# EAGLE schematic RastoMower_bckp220817 (EAGLE 9.6.2)

## Sheet 1 of 2: Input
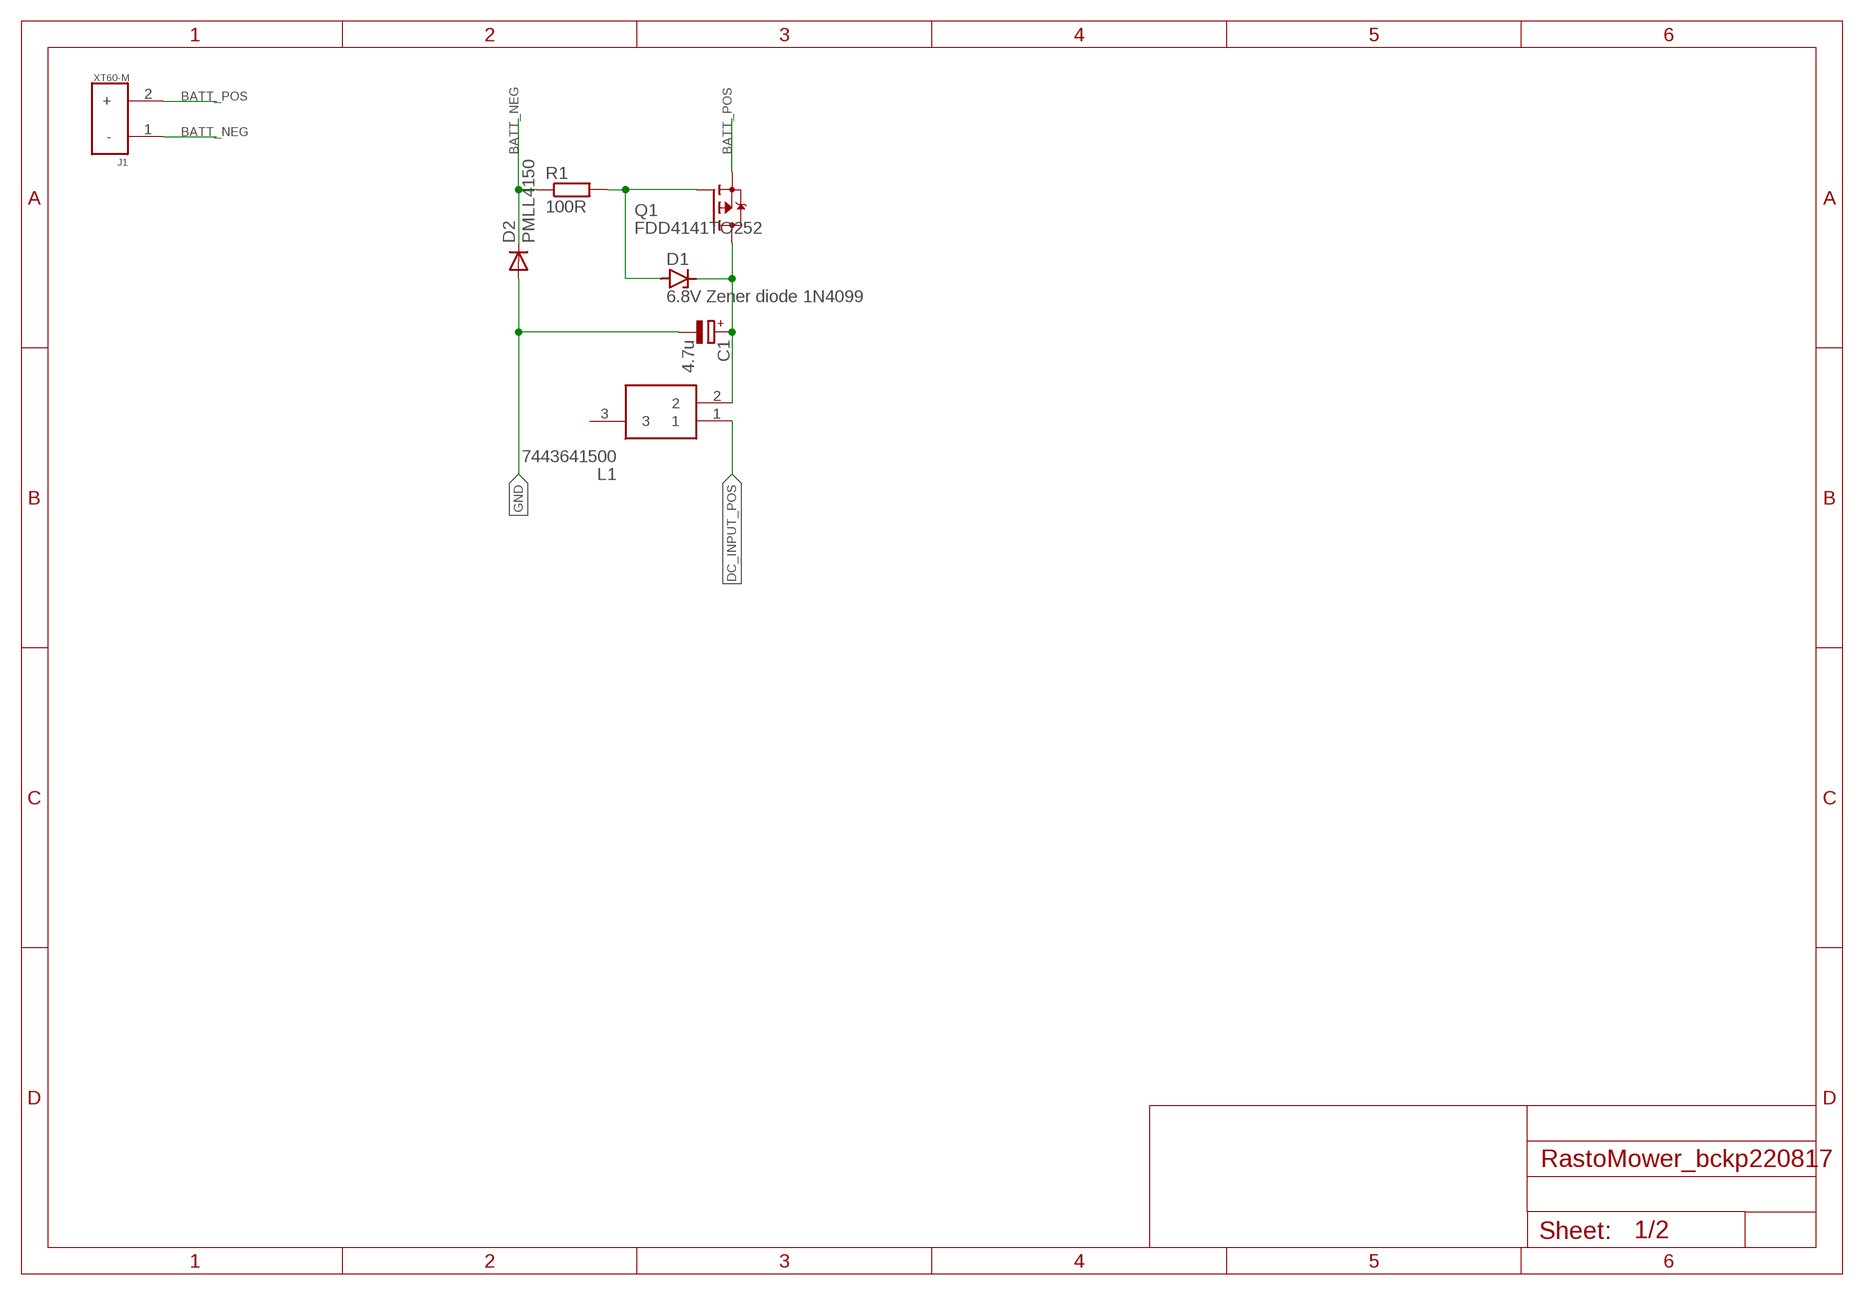
[diagram p0: schematic, sheet 1]

### Parts
C1  4.7u  CPOL-EUE2.5-5  [E2,5-5]
D1  6.8V Zener diode 1N4099  ZENER-DIODEP1-Z12  [P1Z12]
D2  PMLL4150  [SOD80C]
J1  XT60-M  [AMASS_XT60-M]
L1  7443641500  [74436413300]
Q1  FDD4141TO252  [TO252]
R1  100R  R-EU_R0805  [R0805]

### Nets
BATT_NEG: D2.C J1.1(-) R1.1
BATT_POS: J1.2(+) Q1.2(S)
DC_INPUT_POS: L1.1
GND: C1.- D2.A
N$1: D1.A Q1.1(G) R1.2
N$2: C1.+ D1.C L1.2 Q1.3(D)
Unconnected: L1.3

## Sheet 2 of 2
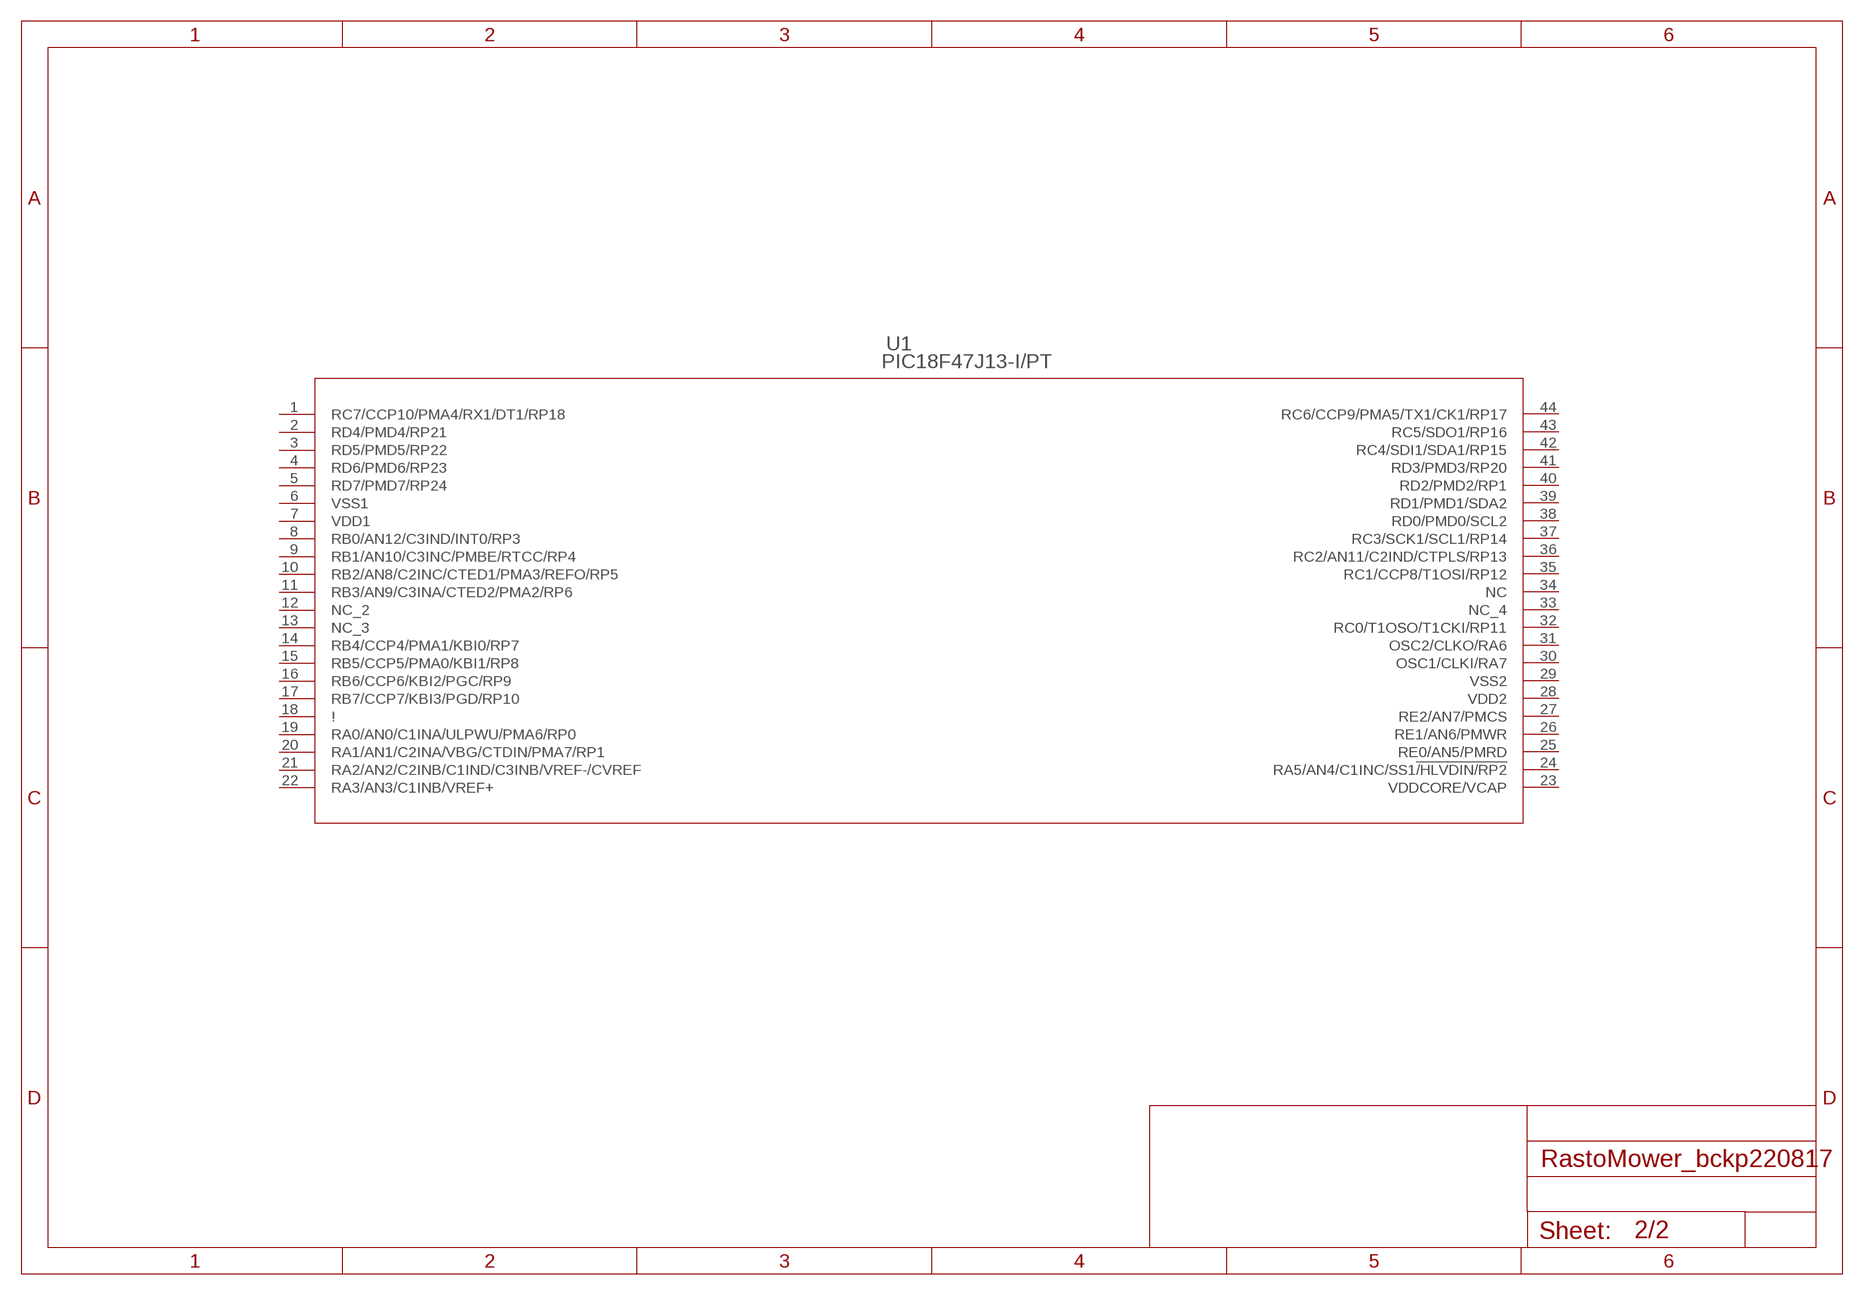
[diagram p1: schematic, sheet 2]

### Parts
U1  PIC18F47J13-I/PT  [TQFP44_10X10MC_MCH]
Unconnected: U1.1(RC7/CCP10/PMA4/RX1/DT1/RP18) U1.2(RD4/PMD4/RP21) U1.3(RD5/PMD5/RP22) U1.4(RD6/PMD6/RP23) U1.5(RD7/PMD7/RP24) U1.8(RB0/AN12/C3IND/INT0/RP3) U1.9(RB1/AN10/C3INC/PMBE/RTCC/RP4) U1.10(RB2/AN8/C2INC/CTED1/PMA3/REFO/RP5) U1.11(RB3/AN9/C3INA/CTED2/PMA2/RP6) U1.12(NC_2) U1.13(NC_3) U1.14(RB4/CCP4/PMA1/KBI0/RP7) U1.15(RB5/CCP5/PMA0/KBI1/RP8) U1.16(RB6/CCP6/KBI2/PGC/RP9) U1.17(RB7/CCP7/KBI3/PGD/RP10) U1.18(!) U1.19(RA0/AN0/C1INA/ULPWU/PMA6/RP0) U1.20(RA1/AN1/C2INA/VBG/CTDIN/PMA7/RP1) U1.21(RA2/AN2/C2INB/C1IND/C3INB/VREF-/CVREF) U1.22(RA3/AN3/C1INB/VREF+) U1.23(VDDCORE/VCAP) U1.24(RA5/AN4/C1INC/SS1!/HLVDIN/RP2) U1.25(RE0/AN5/PMRD) U1.26(RE1/AN6/PMWR) U1.27(RE2/AN7/PMCS) U1.30(OSC1/CLKI/RA7) U1.31(OSC2/CLKO/RA6) U1.32(RC0/T1OSO/T1CKI/RP11) U1.33(NC_4) U1.34(NC) U1.35(RC1/CCP8/T1OSI/RP12) U1.36(RC2/AN11/C2IND/CTPLS/RP13) U1.37(RC3/SCK1/SCL1/RP14) U1.38(RD0/PMD0/SCL2) U1.39(RD1/PMD1/SDA2) U1.40(RD2/PMD2/RP1) U1.41(RD3/PMD3/RP20) U1.42(RC4/SDI1/SDA1/RP15) U1.43(RC5/SDO1/RP16) U1.44(RC6/CCP9/PMA5/TX1/CK1/RP17)

## Power pins joined to a net without a drawn wire
VDD1: U1.7(VDD1)
VDD2: U1.28(VDD2)
VSS1: U1.6(VSS1)
VSS2: U1.29(VSS2)

## Library data of the parts
C1 = rcl:CPOL-EU: POLARIZED CAPACITOR, European symbol; SPICEPREFIX: C
D1 = diode:ZENER-DIODE: Z-Diode
D2 = zkw_diode:PMLL4150: DIODE high speed
J1 = XT60-M:XT60-M: DC supply; XT60; male; PIN:2; for cable; soldered; 60A; 500V Check availability <https://pricing.snapeda.com/parts/XT60-M/AMASS/view-part?ref=eda>; AVAILABILITY: In Stock; DESCRIPTION: Plug; DC supply; XT60; male; PIN: 2; for cable; soldered; 30A; 500V; MF: AMASS; MP: XT60-M; PACKAGE: Package; PRICE: None
L1 = 7443641500:7443641500: Wurth WE-HCF Series Shielded Wire-wound SMD Inductor with a MnZn Core, 15 uH +/-15% 30A Idc Source: Datasheet <http://katalog.we-online.com/pbs/datasheet/7443641500.pdf>; DESCRIPTION: Wurth WE-HCF Series Shielded Wire-wound SMD Inductor with a MnZn Core, 15 uH +/-15% 30A Idc; HEIGHT: 15mm; MANUFACTURER_NAME: Wurth Elektronik; MANUFACTURER_PART_NUMBER: 7443641500; MOUSER_PART_NUMBER: 710-7443641500; MOUSER_PRICE-STOCK: https://www.mouser.co.uk/ProductDetail/Wurth-Elektronik/7443641500?qs=Zt3UNFD9mQgHteqNok2K9A%3D%3D
Q1 = transistor-fet:FDD4141: P-Channel PowerTrench® MOSFET Source: FDD4141.pdf
R1 = rcl:R-EU_: RESISTOR, European symbol; SPICEPREFIX: R
U1 = skorra:PIC18F47J13-I/PT; COPYRIGHT: Copyright (C) 2022 Ultra Librarian. All rights reserved.; MANUFACTURER_PART_NUMBER: pic18f47j13-i/pt; MFR_NAME: Microchip